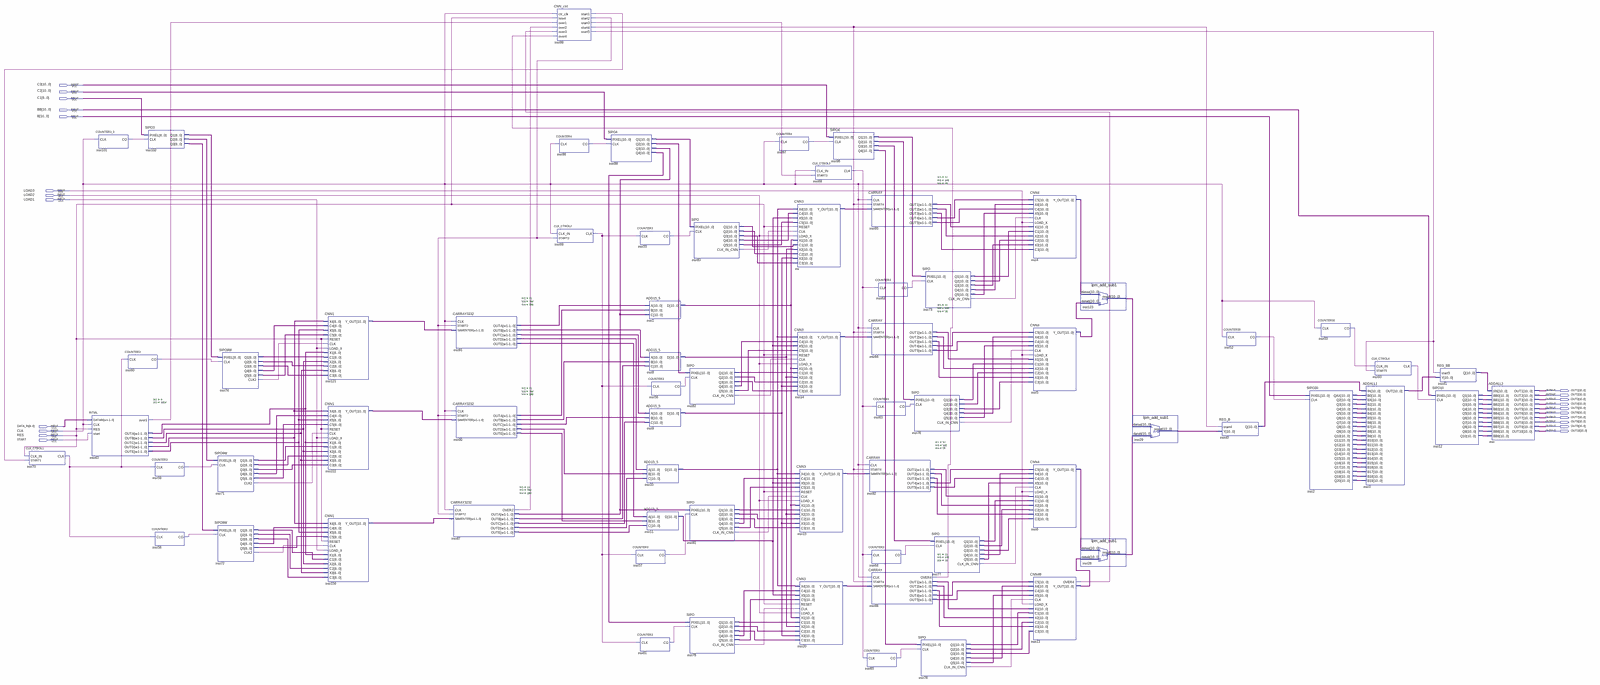
[diagram p0: schematic sheet, whole]
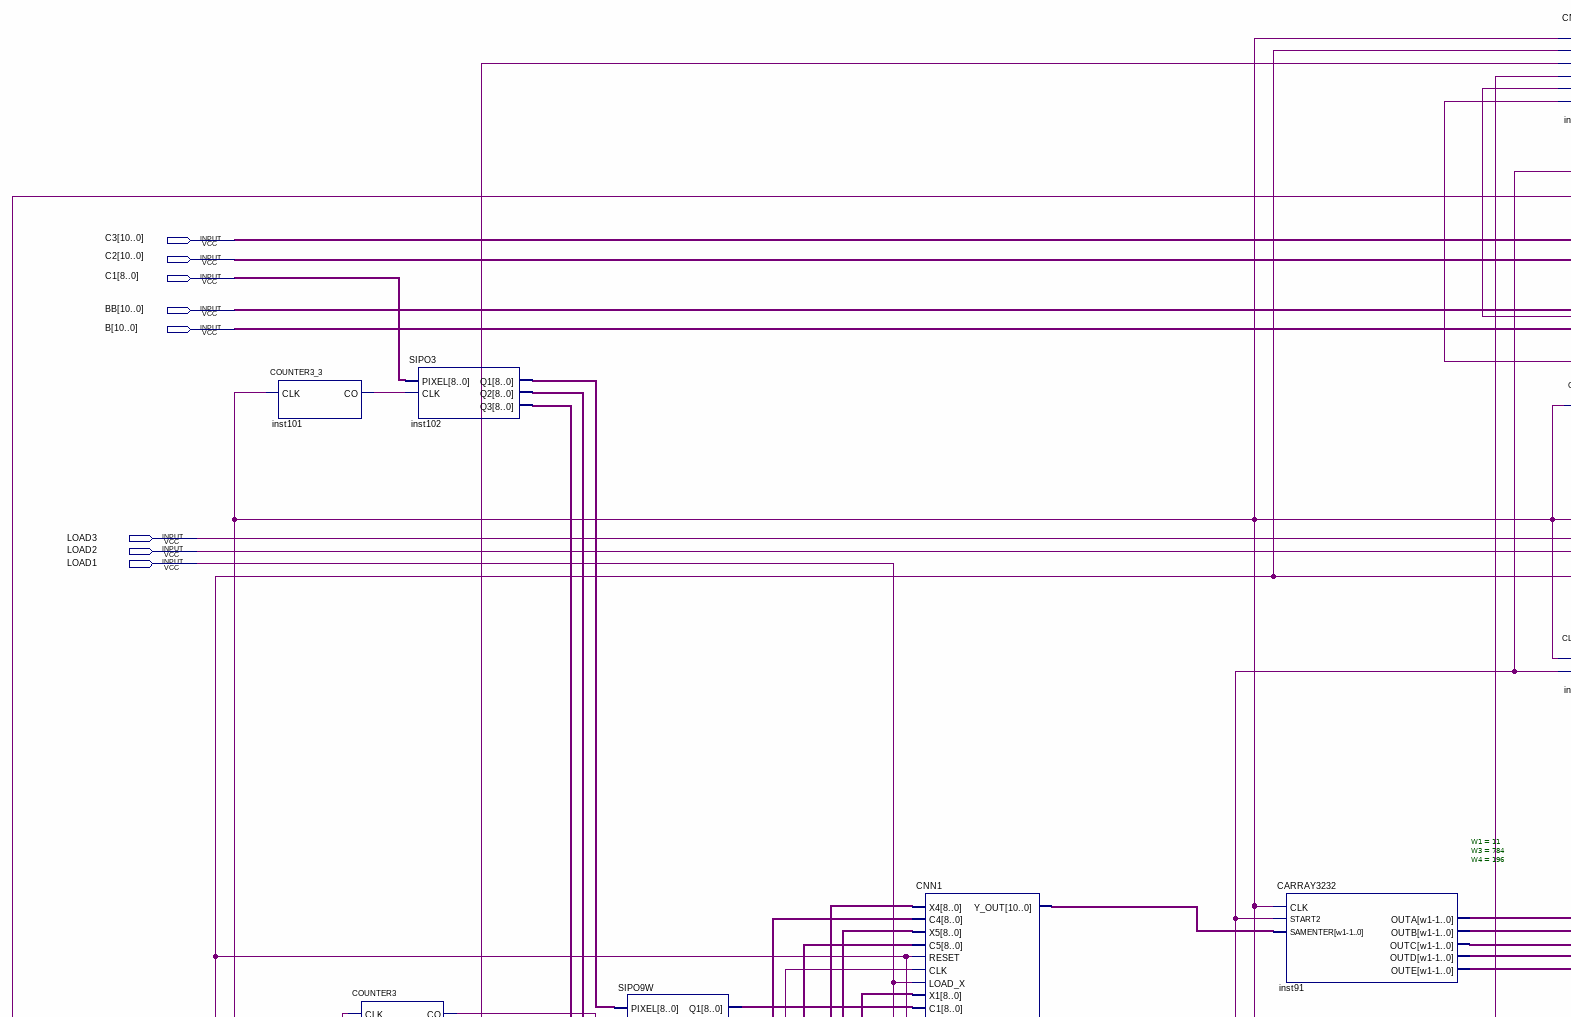
[diagram p1: schematic sheet, upper left part]
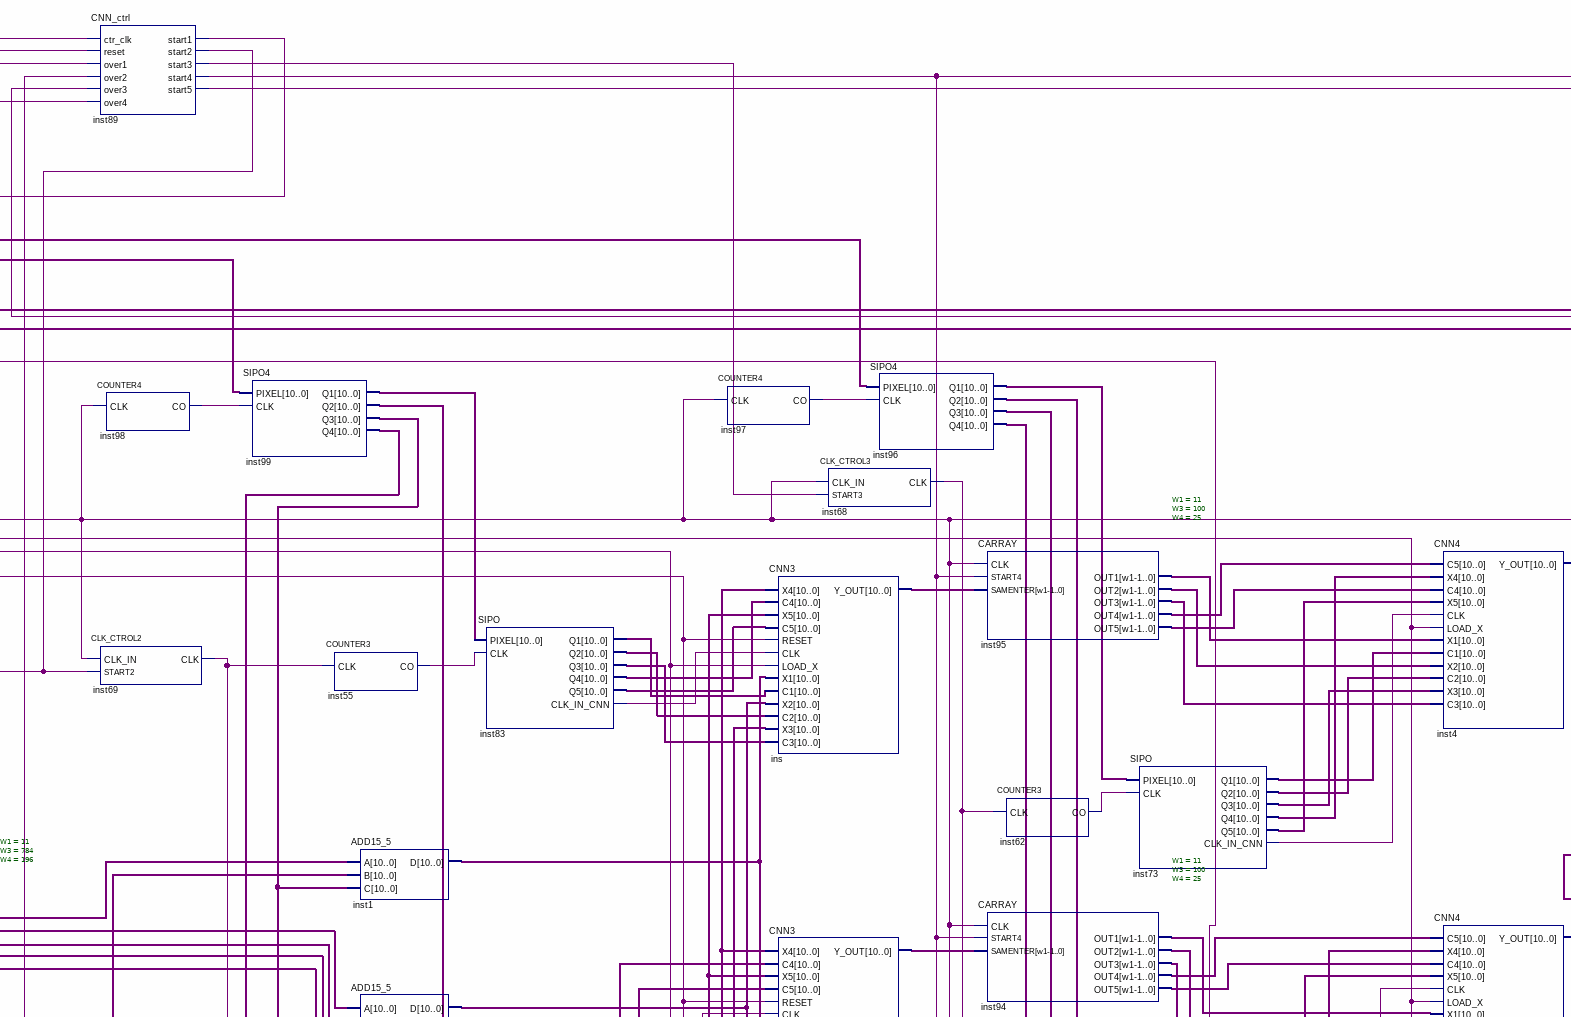
[diagram p2: schematic sheet, upper centre part]
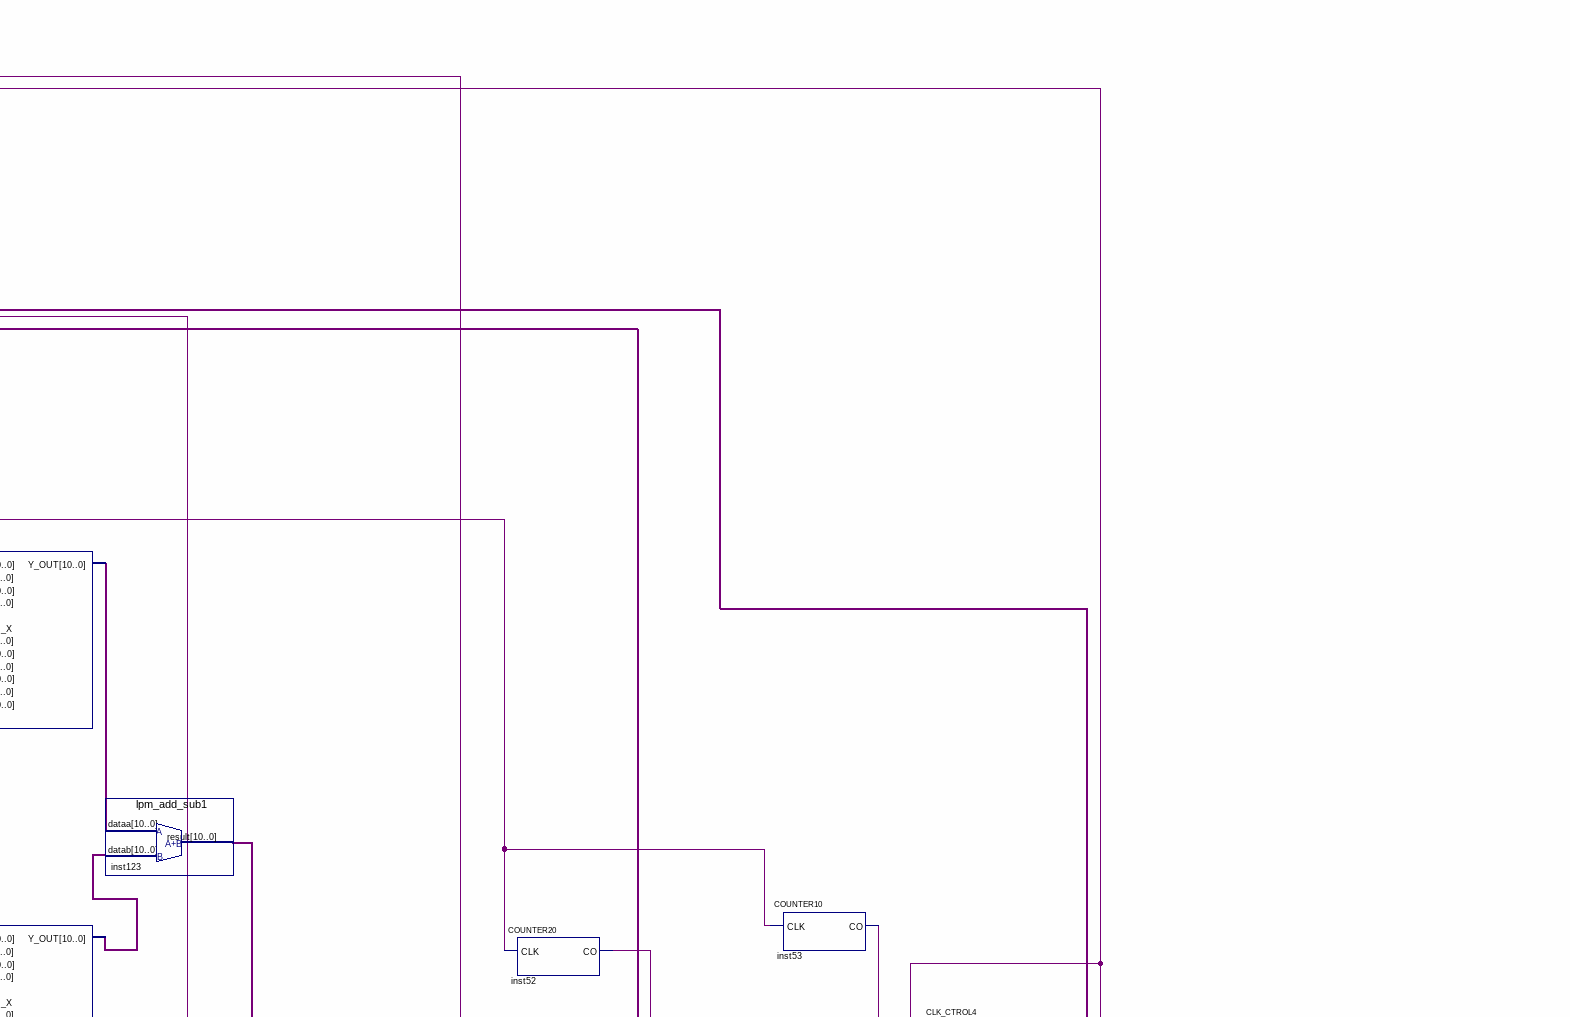
[diagram p3: schematic sheet, upper right part]
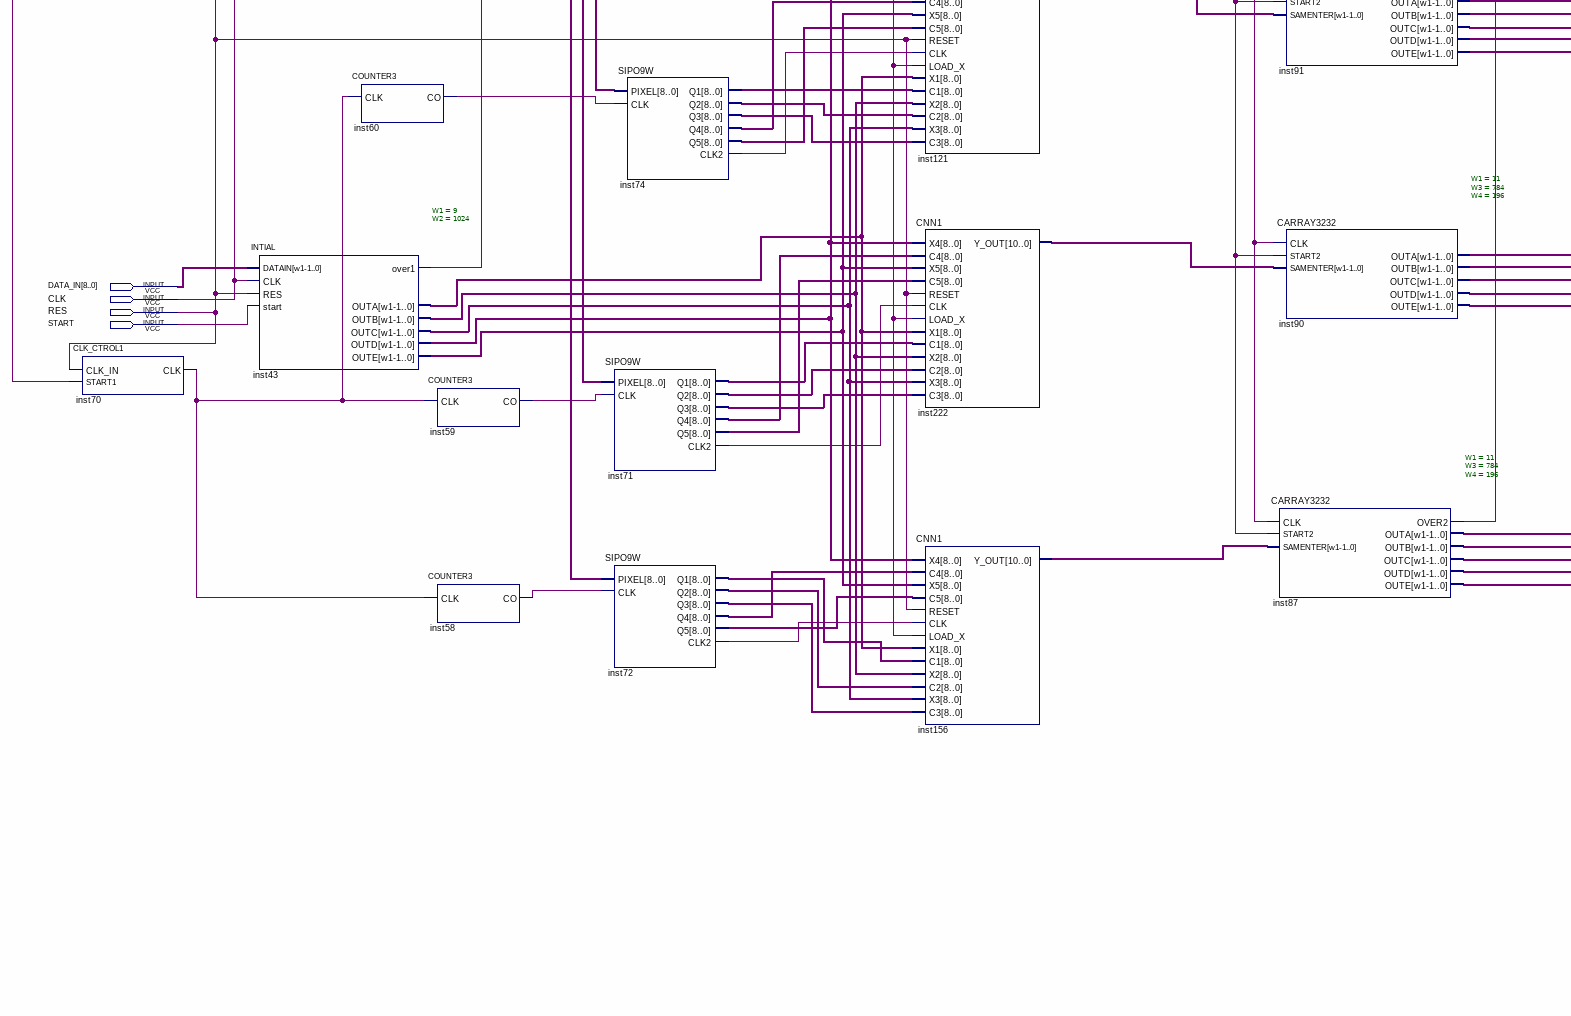
[diagram p4: schematic sheet, lower left part]
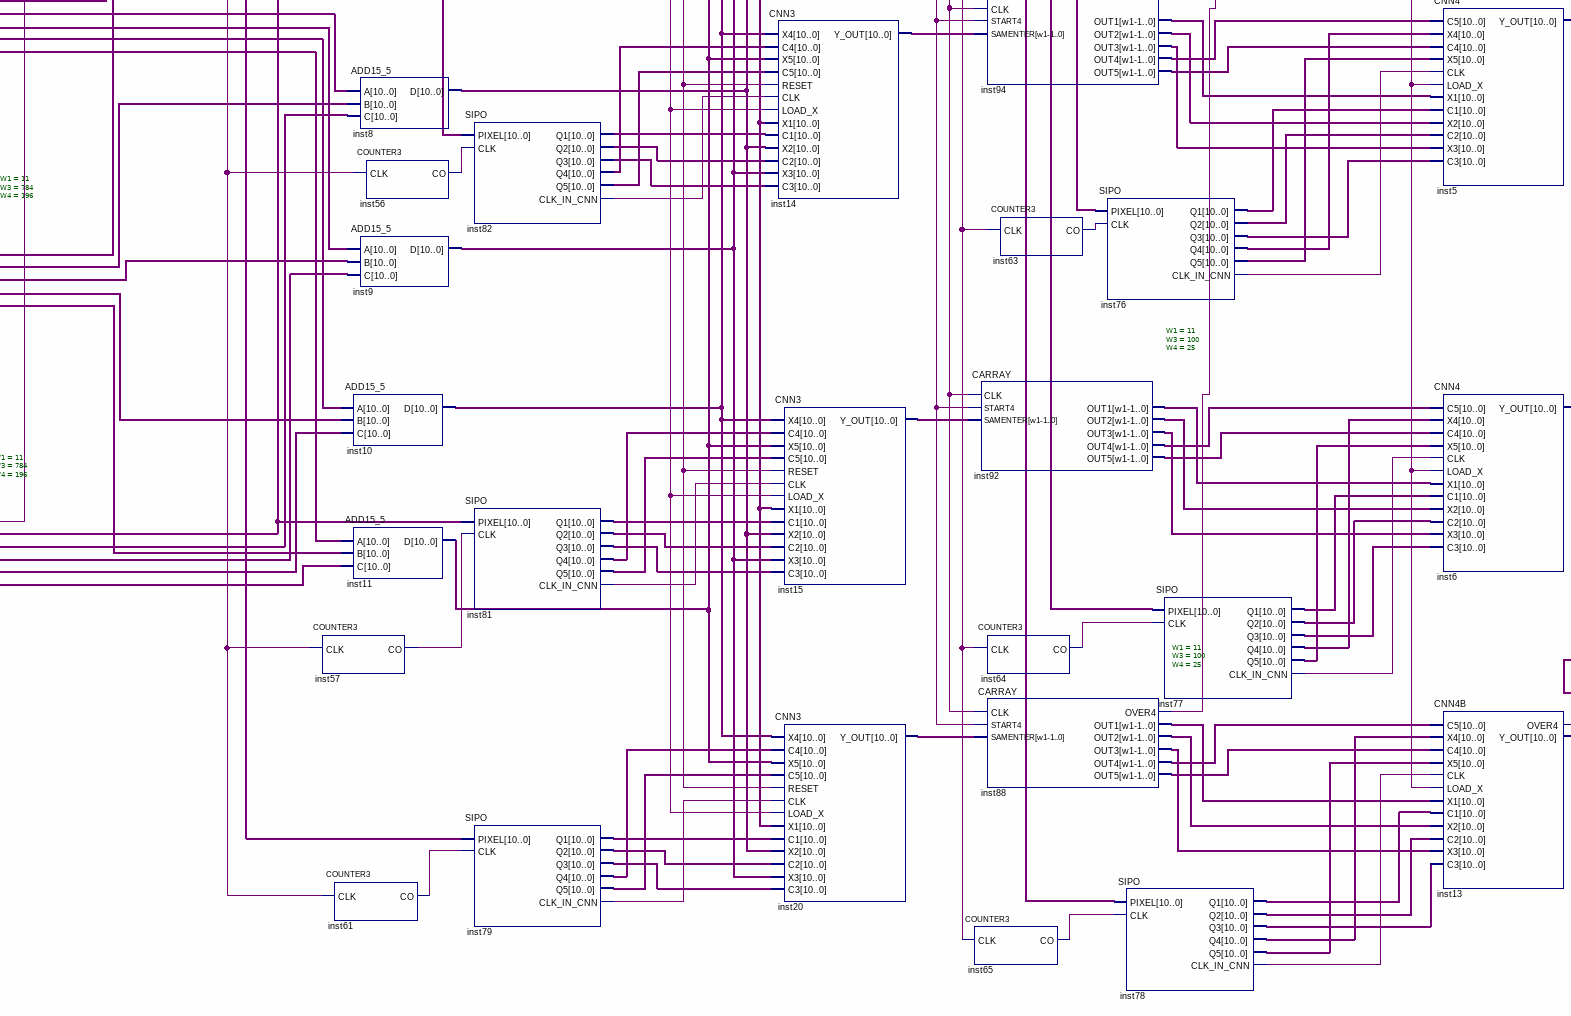
[diagram p5: schematic sheet, lower centre part]
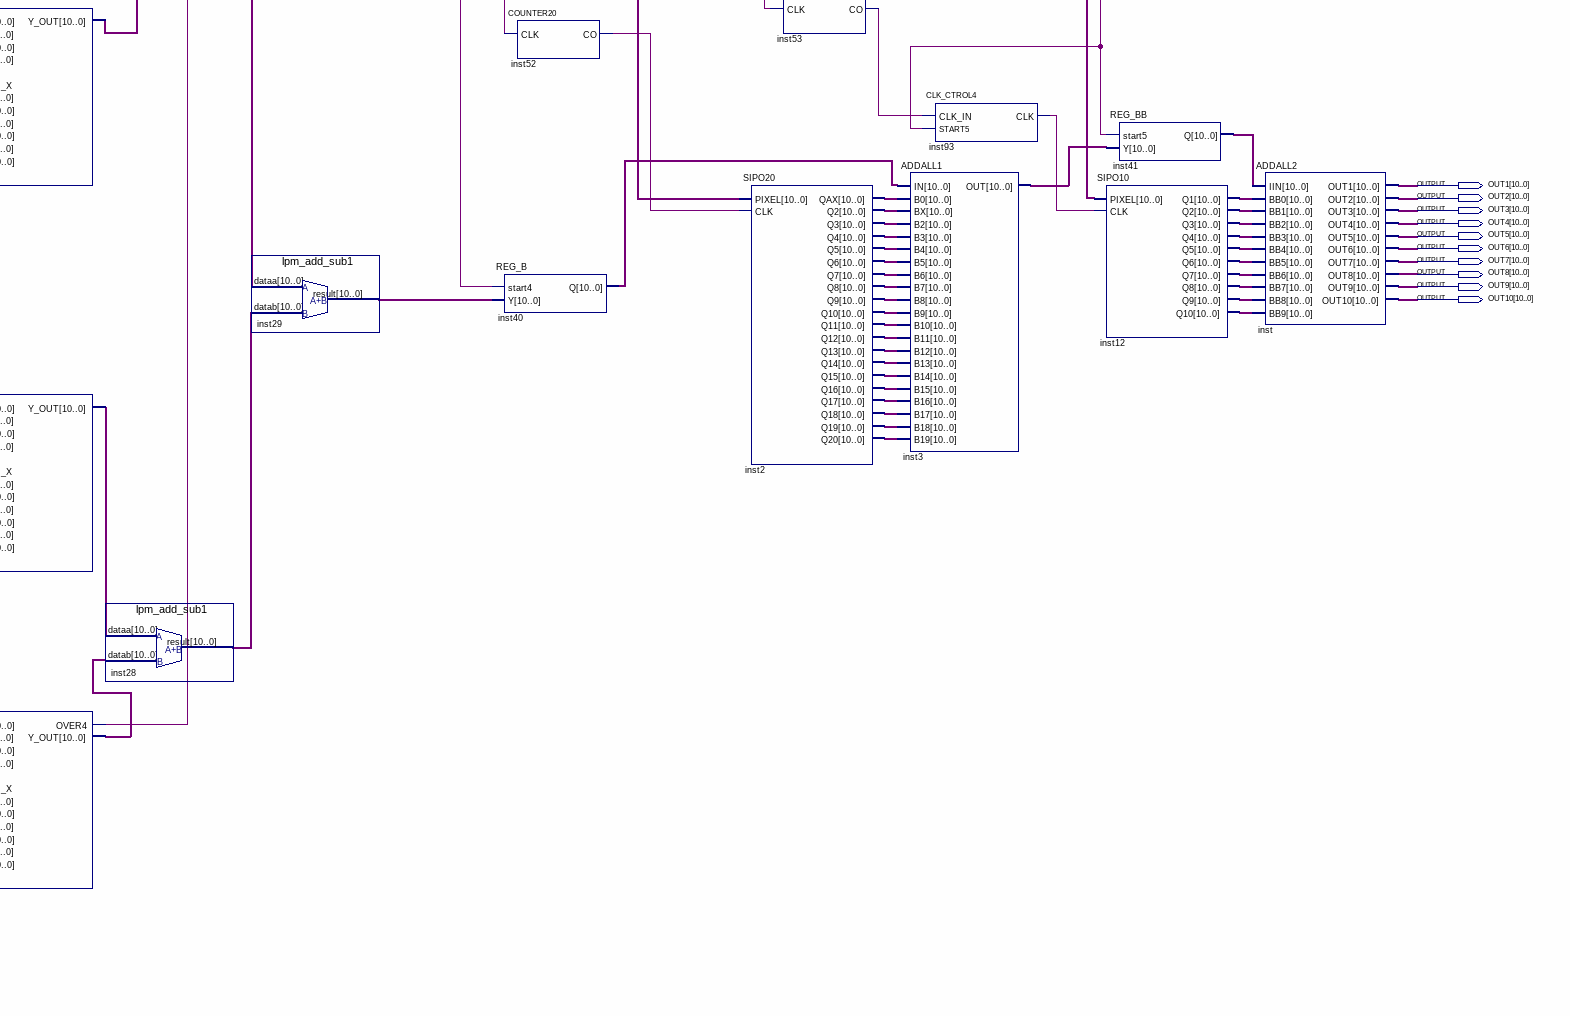
[diagram p6: schematic sheet, lower right part]
// Quartus schematic CNN.bdf as structural Verilog: 68 symbols, 22 pins
module CNN (
  input  [10:0] C3,
  input  [10:0] C2,
  input  [8:0] C1,
  input  [10:0] BB,
  input  [10:0] B,
  input  LOAD3,
  input  LOAD2,
  input  LOAD1,
  input  [8:0] DATA_IN,
  input  CLK,
  input  RES,
  input  START,
  output [10:0] OUT1,
  output [10:0] OUT2,
  output [10:0] OUT3,
  output [10:0] OUT4,
  output [10:0] OUT5,
  output [10:0] OUT6,
  output [10:0] OUT7,
  output [10:0] OUT8,
  output [10:0] OUT9,
  output [10:0] OUT10
);

  wire inst13_over4, inst43_over1, inst52_co, inst53_co, inst55_co, inst56_co, inst57_co, inst58_co,
       inst59_co, inst60_co, inst61_co, inst62_co, inst63_co, inst64_co, inst65_co, inst68_clk, inst69_clk,
       inst70_clk, inst71_clk2, inst72_clk2, inst73_clk_in_cnn, inst74_clk2, inst76_clk_in_cnn,
       inst77_clk_in_cnn, inst78_clk_in_cnn, inst79_clk_in_cnn, inst81_clk_in_cnn, inst82_clk_in_cnn,
       inst83_clk_in_cnn, inst87_over2, inst88_over4, inst89_start1, inst89_start2, inst89_start3,
       inst89_start4, inst89_start5, inst93_clk, inst97_co, inst98_co, inst101_co;
  wire [8:0] inst43_outa, inst43_outb, inst43_outc, inst43_outd, inst43_oute, inst71_q1, inst71_q2,
       inst71_q3, inst71_q4, inst71_q5, inst72_q1, inst72_q2, inst72_q3, inst72_q4, inst72_q5, inst74_q1,
       inst74_q2, inst74_q3, inst74_q4, inst74_q5, inst102_q1, inst102_q2, inst102_q3;
  wire [10:0] ins_y_out, inst1_d, inst2_q2, inst2_q3, inst2_q4, inst2_q5, inst2_q6, inst2_q7, inst2_q8,
       inst2_q9, inst2_q10, inst2_q11, inst2_q12, inst2_q13, inst2_q14, inst2_q15, inst2_q16, inst2_q17,
       inst2_q18, inst2_q19, inst2_q20, inst2_qax, inst3_out, inst4_y_out, inst5_y_out, inst6_y_out, inst8_d,
       inst9_d, inst10_d, inst11_d, inst12_q1, inst12_q2, inst12_q3, inst12_q4, inst12_q5, inst12_q6,
       inst12_q7, inst12_q8, inst12_q9, inst12_q10, inst13_y_out, inst14_y_out, inst15_y_out, inst20_y_out,
       inst28_result, inst29_result, inst40_q, inst41_q, inst73_q1, inst73_q2, inst73_q3, inst73_q4,
       inst73_q5, inst76_q1, inst76_q2, inst76_q3, inst76_q4, inst76_q5, inst77_q1, inst77_q2, inst77_q3,
       inst77_q4, inst77_q5, inst78_q1, inst78_q2, inst78_q3, inst78_q4, inst78_q5, inst79_q1, inst79_q2,
       inst79_q3, inst79_q4, inst79_q5, inst81_q1, inst81_q2, inst81_q3, inst81_q4, inst81_q5, inst82_q1,
       inst82_q2, inst82_q3, inst82_q4, inst82_q5, inst83_q1, inst83_q2, inst83_q3, inst83_q4, inst83_q5,
       inst87_outa, inst87_outb, inst87_outc, inst87_outd, inst87_oute, inst88_out1, inst88_out2,
       inst88_out3, inst88_out4, inst88_out5, inst90_outa, inst90_outb, inst90_outc, inst90_outd,
       inst90_oute, inst91_outa, inst91_outb, inst91_outc, inst91_outd, inst91_oute, inst92_out1,
       inst92_out2, inst92_out3, inst92_out4, inst92_out5, inst94_out1, inst94_out2, inst94_out3,
       inst94_out4, inst94_out5, inst95_out1, inst95_out2, inst95_out3, inst95_out4, inst95_out5, inst96_q1,
       inst96_q2, inst96_q3, inst96_q4, inst99_q1, inst99_q2, inst99_q4, inst121_y_out, inst123_result,
       inst156_y_out, inst222_y_out;

  CLK_CTROL1 inst70 (.CLK_IN(RES), .START1(inst89_start1), .CLK(inst70_clk));
  COUNTER3_3 inst101 (.CLK(CLK), .CO(inst101_co));
  INTIAL #(.W1(9), .W2(1024)) inst43 (
    .CLK(CLK), .DATAIN(DATA_IN), .RES(RES), .start(START), .OUTA(inst43_outa), .OUTB(inst43_outb),
    .OUTC(inst43_outc), .OUTD(inst43_outd), .OUTE(inst43_oute), .over1(inst43_over1));
  COUNTER3 inst60 (.CLK(inst70_clk), .CO(inst60_co));
  SIPO3 inst102 (.PIXEL(C1), .CLK(inst101_co), .Q1(inst102_q1), .Q2(inst102_q2), .Q3(inst102_q3));
  COUNTER3 inst59 (.CLK(inst70_clk), .CO(inst59_co));
  COUNTER3 inst58 (.CLK(inst70_clk), .CO(inst58_co));
  SIPO9W inst74 (
    .PIXEL(inst102_q1), .CLK(inst60_co), .Q1(inst74_q1), .Q2(inst74_q2), .Q3(inst74_q3), .Q4(inst74_q4),
    .Q5(inst74_q5), .CLK2(inst74_clk2));
  SIPO9W inst71 (
    .PIXEL(inst102_q2), .CLK(inst59_co), .Q1(inst71_q1), .Q2(inst71_q2), .Q3(inst71_q3), .Q4(inst71_q4),
    .Q5(inst71_q5), .CLK2(inst71_clk2));
  SIPO9W inst72 (
    .PIXEL(inst102_q3), .CLK(inst58_co), .Q1(inst72_q1), .Q2(inst72_q2), .Q3(inst72_q3), .Q4(inst72_q4),
    .Q5(inst72_q5), .CLK2(inst72_clk2));
  CNN1 inst121 (
    .X4(inst43_outd), .C4(inst74_q4), .X5(inst43_oute), .C5(inst74_q5), .RESET(RES), .CLK(inst74_clk2),
    .LOAD_X(LOAD1), .X1(inst43_outa), .C1(inst74_q1), .X2(inst43_outb), .C2(inst74_q2), .X3(inst43_outc),
    .C3(inst74_q3), .Y_OUT(inst121_y_out));
  CNN1 inst222 (
    .X4(inst43_outd), .C4(inst71_q4), .X5(inst43_oute), .C5(inst71_q5), .RESET(RES), .CLK(inst71_clk2),
    .LOAD_X(LOAD1), .X1(inst43_outa), .C1(inst71_q1), .X2(inst43_outb), .C2(inst71_q2), .X3(inst43_outc),
    .C3(inst71_q3), .Y_OUT(inst222_y_out));
  CNN1 inst156 (
    .X4(inst43_outd), .C4(inst72_q4), .X5(inst43_oute), .C5(inst72_q5), .RESET(RES), .CLK(inst72_clk2),
    .LOAD_X(LOAD1), .X1(inst43_outa), .C1(inst72_q1), .X2(inst43_outb), .C2(inst72_q2), .X3(inst43_outc),
    .C3(inst72_q3), .Y_OUT(inst156_y_out));
  CARRAY3232 #(.W1(11), .W3(784), .W4(196)) inst91 (
    .CLK(CLK), .SAMENTER(inst121_y_out), .START2(inst89_start2), .OUTA(inst91_outa), .OUTB(inst91_outb),
    .OUTC(inst91_outc), .OUTD(inst91_outd), .OUTE(inst91_oute));
  CARRAY3232 #(.W1(11), .W3(784), .W4(196)) inst90 (
    .CLK(CLK), .SAMENTER(inst222_y_out), .START2(inst89_start2), .OUTA(inst90_outa), .OUTB(inst90_outb),
    .OUTC(inst90_outc), .OUTD(inst90_outd), .OUTE(inst90_oute));
  CARRAY3232 #(.W1(11), .W3(784), .W4(196)) inst87 (
    .CLK(CLK), .START2(inst89_start2), .SAMENTER(inst156_y_out), .OVER2(inst87_over2), .OUTA(inst87_outa),
    .OUTB(inst87_outb), .OUTC(inst87_outc), .OUTD(inst87_outd), .OUTE(inst87_oute));
  CNN_ctrl inst89 (
    .ctr_clk(CLK), .reset(RES), .over1(inst43_over1), .over2(inst87_over2), .over3(inst13_over4),
    .over4(inst88_over4), .start1(inst89_start1), .start2(inst89_start2), .start3(inst89_start3),
    .start4(inst89_start4), .start5(inst89_start5));
  COUNTER4 inst98 (.CLK(CLK), .CO(inst98_co));
  CLK_CTROL2 inst69 (.CLK_IN(CLK), .START2(inst89_start2), .CLK(inst69_clk));
  SIPO4 inst99 (.PIXEL(C2), .CLK(inst98_co), .Q1(inst99_q1), .Q2(inst99_q2), .Q3(inst87_outa), .Q4(inst99_q4));
  COUNTER3 inst55 (.CLK(inst69_clk), .CO(inst55_co));
  COUNTER3 inst57 (.CLK(inst69_clk), .CO(inst57_co));
  COUNTER3 inst61 (.CLK(inst69_clk), .CO(inst61_co));
  ADD15_5 inst1 (.A(inst91_outa), .B(inst90_outa), .C(inst87_outa), .D(inst1_d));
  ADD15_5 inst8 (.A(inst91_outb), .B(inst90_outb), .C(inst87_outb), .D(inst8_d));
  COUNTER3 inst56 (.CLK(inst69_clk), .CO(inst56_co));
  ADD15_5 inst9 (.A(inst91_outc), .B(inst90_outc), .C(inst87_outc), .D(inst9_d));
  ADD15_5 inst10 (.A(inst91_outd), .B(inst90_outd), .C(inst87_outd), .D(inst10_d));
  ADD15_5 inst11 (.A(inst91_oute), .B(inst90_oute), .C(inst87_oute), .D(inst11_d));
  SIPO inst83 (
    .PIXEL(inst99_q1), .CLK(inst55_co), .Q1(inst83_q1), .Q2(inst83_q2), .Q3(inst83_q3), .Q4(inst83_q4),
    .Q5(inst83_q5), .CLK_IN_CNN(inst83_clk_in_cnn));
  SIPO inst82 (
    .PIXEL(inst99_q2), .CLK(inst56_co), .Q1(inst82_q1), .Q2(inst82_q2), .Q3(inst82_q3), .Q4(inst82_q4),
    .Q5(inst82_q5), .CLK_IN_CNN(inst82_clk_in_cnn));
  SIPO inst81 (
    .PIXEL(inst87_outa), .CLK(inst57_co), .Q1(inst81_q1), .Q2(inst81_q2), .Q3(inst81_q3), .Q4(inst81_q4),
    .Q5(inst81_q5), .CLK_IN_CNN(inst81_clk_in_cnn));
  SIPO inst79 (
    .PIXEL(inst99_q4), .CLK(inst61_co), .Q1(inst79_q1), .Q2(inst79_q2), .Q3(inst79_q3), .Q4(inst79_q4),
    .Q5(inst79_q5), .CLK_IN_CNN(inst79_clk_in_cnn));
  COUNTER4 inst97 (.CLK(CLK), .CO(inst97_co));
  CNN3 ins (
    .X4(inst10_d), .C4(inst83_q4), .X5(inst11_d), .C5(inst83_q5), .RESET(RES), .CLK(inst83_clk_in_cnn),
    .LOAD_X(LOAD2), .X1(inst1_d), .C1(inst83_q1), .X2(inst8_d), .C2(inst83_q2), .X3(inst9_d), .C3(inst83_q3),
    .Y_OUT(ins_y_out));
  CNN3 inst14 (
    .X4(inst10_d), .C4(inst82_q4), .X5(inst11_d), .C5(inst82_q5), .RESET(RES), .CLK(inst82_clk_in_cnn),
    .LOAD_X(LOAD2), .X1(inst1_d), .C1(inst82_q1), .X2(inst8_d), .C2(inst82_q2), .X3(inst9_d), .C3(inst82_q3),
    .Y_OUT(inst14_y_out));
  CNN3 inst15 (
    .X4(inst10_d), .C4(inst81_q4), .X5(inst11_d), .C5(inst81_q5), .RESET(RES), .CLK(inst81_clk_in_cnn),
    .LOAD_X(LOAD2), .X1(inst1_d), .C1(inst81_q1), .X2(inst8_d), .C2(inst81_q2), .X3(inst9_d), .C3(inst81_q3),
    .Y_OUT(inst15_y_out));
  CNN3 inst20 (
    .X4(inst10_d), .C4(inst79_q4), .X5(inst11_d), .C5(inst79_q5), .RESET(RES), .CLK(inst79_clk_in_cnn),
    .LOAD_X(LOAD2), .X1(inst1_d), .C1(inst79_q1), .X2(inst8_d), .C2(inst79_q2), .X3(inst9_d), .C3(inst79_q3),
    .Y_OUT(inst20_y_out));
  CLK_CTROL3 inst68 (.CLK_IN(CLK), .START3(inst89_start3), .CLK(inst68_clk));
  SIPO4 inst96 (.PIXEL(C3), .CLK(inst97_co), .Q1(inst96_q1), .Q2(inst96_q2), .Q3(inst96_q3), .Q4(inst96_q4));
  CARRAY #(.W1(11), .W3(100), .W4(25)) inst95 (
    .CLK(CLK), .SAMENTER(ins_y_out), .START4(inst89_start4), .OUT1(inst95_out1), .OUT2(inst95_out2),
    .OUT3(inst95_out3), .OUT4(inst95_out4), .OUT5(inst95_out5));
  CARRAY #(.W1(11), .W3(100), .W4(25)) inst94 (
    .CLK(CLK), .SAMENTER(inst14_y_out), .START4(inst89_start4), .OUT1(inst94_out1), .OUT2(inst94_out2),
    .OUT3(inst94_out3), .OUT4(inst94_out4), .OUT5(inst94_out5));
  COUNTER3 inst63 (.CLK(inst68_clk), .CO(inst63_co));
  CARRAY #(.W1(11), .W3(100), .W4(25)) inst92 (
    .CLK(CLK), .SAMENTER(inst15_y_out), .START4(inst89_start4), .OUT1(inst92_out1), .OUT2(inst92_out2),
    .OUT3(inst92_out3), .OUT4(inst92_out4), .OUT5(inst92_out5));
  COUNTER3 inst64 (.CLK(inst68_clk), .CO(inst64_co));
  CARRAY #(.W1(11), .W3(100), .W4(25)) inst88 (
    .CLK(CLK), .START4(inst89_start4), .SAMENTER(inst20_y_out), .OVER4(inst88_over4), .OUT1(inst88_out1),
    .OUT2(inst88_out2), .OUT3(inst88_out3), .OUT4(inst88_out4), .OUT5(inst88_out5));
  COUNTER3 inst65 (.CLK(inst68_clk), .CO(inst65_co));
  COUNTER3 inst62 (.CLK(inst68_clk), .CO(inst62_co));
  SIPO inst73 (
    .PIXEL(inst96_q1), .CLK(inst62_co), .Q1(inst73_q1), .Q2(inst73_q2), .Q3(inst73_q3), .Q4(inst73_q4),
    .Q5(inst73_q5), .CLK_IN_CNN(inst73_clk_in_cnn));
  SIPO inst76 (
    .PIXEL(inst96_q2), .CLK(inst63_co), .Q1(inst76_q1), .Q2(inst76_q2), .Q3(inst76_q3), .Q4(inst76_q4),
    .Q5(inst76_q5), .CLK_IN_CNN(inst76_clk_in_cnn));
  SIPO inst78 (
    .PIXEL(inst96_q4), .CLK(inst65_co), .Q1(inst78_q1), .Q2(inst78_q2), .Q3(inst78_q3), .Q4(inst78_q4),
    .Q5(inst78_q5), .CLK_IN_CNN(inst78_clk_in_cnn));
  SIPO inst77 (
    .PIXEL(inst96_q3), .CLK(inst64_co), .Q1(inst77_q1), .Q2(inst77_q2), .Q3(inst77_q3), .Q4(inst77_q4),
    .Q5(inst77_q5), .CLK_IN_CNN(inst77_clk_in_cnn));
  CNN4 inst4 (
    .C5(inst95_out4), .X4(inst73_q4), .C4(inst95_out5), .X5(inst73_q5), .CLK(inst73_clk_in_cnn),
    .LOAD_X(LOAD3), .X1(inst95_out1), .C1(inst73_q1), .X2(inst95_out2), .C2(inst73_q2), .X3(inst73_q3),
    .C3(inst95_out3), .Y_OUT(inst4_y_out));
  CNN4 inst5 (
    .C5(inst94_out4), .X4(inst76_q4), .C4(inst94_out5), .X5(inst76_q5), .CLK(inst76_clk_in_cnn),
    .LOAD_X(LOAD3), .X1(inst94_out1), .C1(inst76_q1), .X2(inst94_out2), .C2(inst76_q2), .X3(inst94_out3),
    .C3(inst76_q3), .Y_OUT(inst5_y_out));
  CNN4 inst6 (
    .C5(inst92_out4), .X4(inst77_q4), .C4(inst92_out5), .X5(inst77_q5), .CLK(inst77_clk_in_cnn),
    .LOAD_X(LOAD3), .X1(inst92_out1), .C1(inst77_q1), .X2(inst92_out2), .C2(inst77_q2), .X3(inst92_out3),
    .C3(inst77_q3), .Y_OUT(inst6_y_out));
  CNN4B inst13 (
    .C5(inst88_out4), .X4(inst78_q4), .C4(inst88_out5), .X5(inst78_q5), .CLK(inst78_clk_in_cnn),
    .LOAD_X(LOAD3), .X1(inst88_out1), .C1(inst78_q1), .X2(inst88_out2), .C2(inst78_q2), .X3(inst88_out3),
    .C3(inst78_q3), .OVER4(inst13_over4), .Y_OUT(inst13_y_out));
  lpm_add_sub1 inst123 (.dataa(inst4_y_out), .datab(inst5_y_out), .result(inst123_result));
  lpm_add_sub1 inst28 (.dataa(inst6_y_out), .datab(inst13_y_out), .result(inst28_result));
  lpm_add_sub1 inst29 (.dataa(inst123_result), .datab(inst28_result), .result(inst29_result));
  COUNTER20 inst52 (.CLK(CLK), .CO(inst52_co));
  REG_B inst40 (.start4(inst89_start4), .Y(inst29_result), .Q(inst40_q));
  COUNTER10 inst53 (.CLK(CLK), .CO(inst53_co));
  SIPO20 inst2 (
    .PIXEL(B), .CLK(inst52_co), .QAX(inst2_qax), .Q2(inst2_q2), .Q3(inst2_q3), .Q4(inst2_q4), .Q5(inst2_q5),
    .Q6(inst2_q6), .Q7(inst2_q7), .Q8(inst2_q8), .Q9(inst2_q9), .Q10(inst2_q10), .Q11(inst2_q11),
    .Q12(inst2_q12), .Q13(inst2_q13), .Q14(inst2_q14), .Q15(inst2_q15), .Q16(inst2_q16), .Q17(inst2_q17),
    .Q18(inst2_q18), .Q19(inst2_q19), .Q20(inst2_q20));
  CLK_CTROL4 inst93 (.CLK_IN(inst53_co), .START5(inst89_start5), .CLK(inst93_clk));
  ADDALL1 inst3 (
    .IN(inst40_q), .B0(inst2_qax), .BX(inst2_q2), .B2(inst2_q3), .B3(inst2_q4), .B4(inst2_q5), .B5(inst2_q6),
    .B6(inst2_q7), .B7(inst2_q8), .B8(inst2_q9), .B9(inst2_q10), .B10(inst2_q11), .B11(inst2_q12),
    .B12(inst2_q13), .B13(inst2_q14), .B14(inst2_q15), .B15(inst2_q16), .B16(inst2_q17), .B17(inst2_q18),
    .B18(inst2_q19), .B19(inst2_q20), .OUT(inst3_out));
  REG_BB inst41 (.start5(inst89_start5), .Y(inst3_out), .Q(inst41_q));
  SIPO10 inst12 (
    .PIXEL(BB), .CLK(inst93_clk), .Q1(inst12_q1), .Q2(inst12_q2), .Q3(inst12_q3), .Q4(inst12_q4),
    .Q5(inst12_q5), .Q6(inst12_q6), .Q7(inst12_q7), .Q8(inst12_q8), .Q9(inst12_q9), .Q10(inst12_q10));
  ADDALL2 inst (
    .IIN(inst41_q), .BB0(inst12_q1), .BB1(inst12_q2), .BB2(inst12_q3), .BB3(inst12_q4), .BB4(inst12_q5),
    .BB5(inst12_q6), .BB6(inst12_q7), .BB7(inst12_q8), .BB8(inst12_q9), .BB9(inst12_q10), .OUT1(OUT1),
    .OUT2(OUT2), .OUT3(OUT3), .OUT4(OUT4), .OUT5(OUT5), .OUT6(OUT6), .OUT7(OUT7), .OUT8(OUT8), .OUT9(OUT9),
    .OUT10(OUT10));
endmodule
